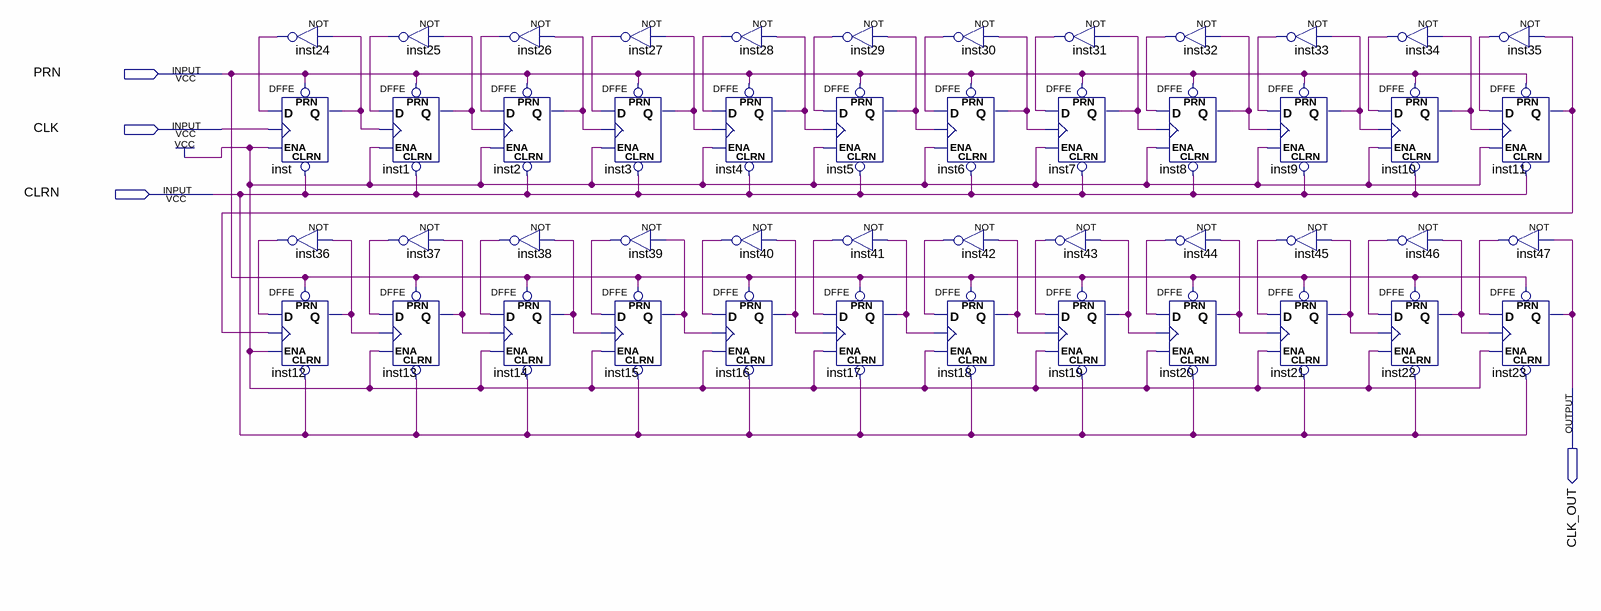
[diagram p0: schematic sheet]
// Quartus schematic freq_div.bdf as structural Verilog: 48 symbols, 4 pins
module freq_div (
  input  PRN,
  input  CLK,
  input  CLRN,
  output CLK_OUT
);

  wire inst1_q, inst2_q, inst3_q, inst4_q, inst5_q, inst6_q, inst7_q, inst8_q, inst9_q, inst10_q, inst11_q,
       inst12_q, inst13_q, inst14_q, inst15_q, inst16_q, inst17_q, inst18_q, inst19_q, inst20_q, inst21_q,
       inst22_q, inst24_out, inst25_out, inst26_out, inst27_out, inst28_out, inst29_out, inst30_out,
       inst31_out, inst32_out, inst33_out, inst34_out, inst35_out, inst36_out, inst37_out, inst38_out,
       inst39_out, inst40_out, inst41_out, inst42_out, inst43_out, inst44_out, inst45_out, inst46_out,
       inst47_out, inst_q;

  not inst24 (inst24_out, inst_q);
  DFFE inst (.PRN(PRN), .CLRN(CLRN), .D(inst24_out), .CLK(CLK), .ENA(1'b1), .Q(inst_q));
  not inst36 (inst36_out, inst12_q);
  DFFE inst12 (.PRN(PRN), .CLRN(CLRN), .D(inst36_out), .CLK(inst11_q), .ENA(1'b1), .Q(inst12_q));
  not inst25 (inst25_out, inst1_q);
  DFFE inst1 (.PRN(PRN), .CLRN(CLRN), .D(inst25_out), .CLK(inst_q), .ENA(1'b1), .Q(inst1_q));
  not inst37 (inst37_out, inst13_q);
  DFFE inst13 (.PRN(PRN), .CLRN(CLRN), .D(inst37_out), .CLK(inst12_q), .ENA(1'b1), .Q(inst13_q));
  not inst26 (inst26_out, inst2_q);
  DFFE inst2 (.PRN(PRN), .CLRN(CLRN), .D(inst26_out), .CLK(inst1_q), .ENA(1'b1), .Q(inst2_q));
  not inst38 (inst38_out, inst14_q);
  DFFE inst14 (.PRN(PRN), .CLRN(CLRN), .D(inst38_out), .CLK(inst13_q), .ENA(1'b1), .Q(inst14_q));
  not inst27 (inst27_out, inst3_q);
  DFFE inst3 (.PRN(PRN), .CLRN(CLRN), .D(inst27_out), .CLK(inst2_q), .ENA(1'b1), .Q(inst3_q));
  not inst39 (inst39_out, inst15_q);
  DFFE inst15 (.PRN(PRN), .CLRN(CLRN), .D(inst39_out), .CLK(inst14_q), .ENA(1'b1), .Q(inst15_q));
  not inst28 (inst28_out, inst4_q);
  DFFE inst4 (.PRN(PRN), .CLRN(CLRN), .D(inst28_out), .CLK(inst3_q), .ENA(1'b1), .Q(inst4_q));
  not inst40 (inst40_out, inst16_q);
  DFFE inst16 (.PRN(PRN), .CLRN(CLRN), .D(inst40_out), .CLK(inst15_q), .ENA(1'b1), .Q(inst16_q));
  not inst29 (inst29_out, inst5_q);
  DFFE inst5 (.PRN(PRN), .CLRN(CLRN), .D(inst29_out), .CLK(inst4_q), .ENA(1'b1), .Q(inst5_q));
  not inst41 (inst41_out, inst17_q);
  DFFE inst17 (.PRN(PRN), .CLRN(CLRN), .D(inst41_out), .CLK(inst16_q), .ENA(1'b1), .Q(inst17_q));
  not inst30 (inst30_out, inst6_q);
  DFFE inst6 (.PRN(PRN), .CLRN(CLRN), .D(inst30_out), .CLK(inst5_q), .ENA(1'b1), .Q(inst6_q));
  not inst42 (inst42_out, inst18_q);
  DFFE inst18 (.PRN(PRN), .CLRN(CLRN), .D(inst42_out), .CLK(inst17_q), .ENA(1'b1), .Q(inst18_q));
  not inst31 (inst31_out, inst7_q);
  DFFE inst7 (.PRN(PRN), .CLRN(CLRN), .D(inst31_out), .CLK(inst6_q), .ENA(1'b1), .Q(inst7_q));
  not inst43 (inst43_out, inst19_q);
  DFFE inst19 (.PRN(PRN), .CLRN(CLRN), .D(inst43_out), .CLK(inst18_q), .ENA(1'b1), .Q(inst19_q));
  not inst32 (inst32_out, inst8_q);
  DFFE inst8 (.PRN(PRN), .CLRN(CLRN), .D(inst32_out), .CLK(inst7_q), .ENA(1'b1), .Q(inst8_q));
  not inst44 (inst44_out, inst20_q);
  DFFE inst20 (.PRN(PRN), .CLRN(CLRN), .D(inst44_out), .CLK(inst19_q), .ENA(1'b1), .Q(inst20_q));
  not inst33 (inst33_out, inst9_q);
  DFFE inst9 (.PRN(PRN), .CLRN(CLRN), .D(inst33_out), .CLK(inst8_q), .ENA(1'b1), .Q(inst9_q));
  not inst45 (inst45_out, inst21_q);
  DFFE inst21 (.PRN(PRN), .CLRN(CLRN), .D(inst45_out), .CLK(inst20_q), .ENA(1'b1), .Q(inst21_q));
  not inst34 (inst34_out, inst10_q);
  DFFE inst10 (.PRN(PRN), .CLRN(CLRN), .D(inst34_out), .CLK(inst9_q), .ENA(1'b1), .Q(inst10_q));
  not inst46 (inst46_out, inst22_q);
  DFFE inst22 (.PRN(PRN), .CLRN(CLRN), .D(inst46_out), .CLK(inst21_q), .ENA(1'b1), .Q(inst22_q));
  not inst35 (inst35_out, inst11_q);
  DFFE inst11 (.PRN(PRN), .CLRN(CLRN), .D(inst35_out), .CLK(inst10_q), .ENA(1'b1), .Q(inst11_q));
  not inst47 (inst47_out, CLK_OUT);
  DFFE inst23 (.PRN(PRN), .CLRN(CLRN), .D(inst47_out), .CLK(inst22_q), .ENA(1'b1), .Q(CLK_OUT));
endmodule
